# EAGLE design BLDCM (EAGLE 9.4.2)

## Sheet 1 of 4
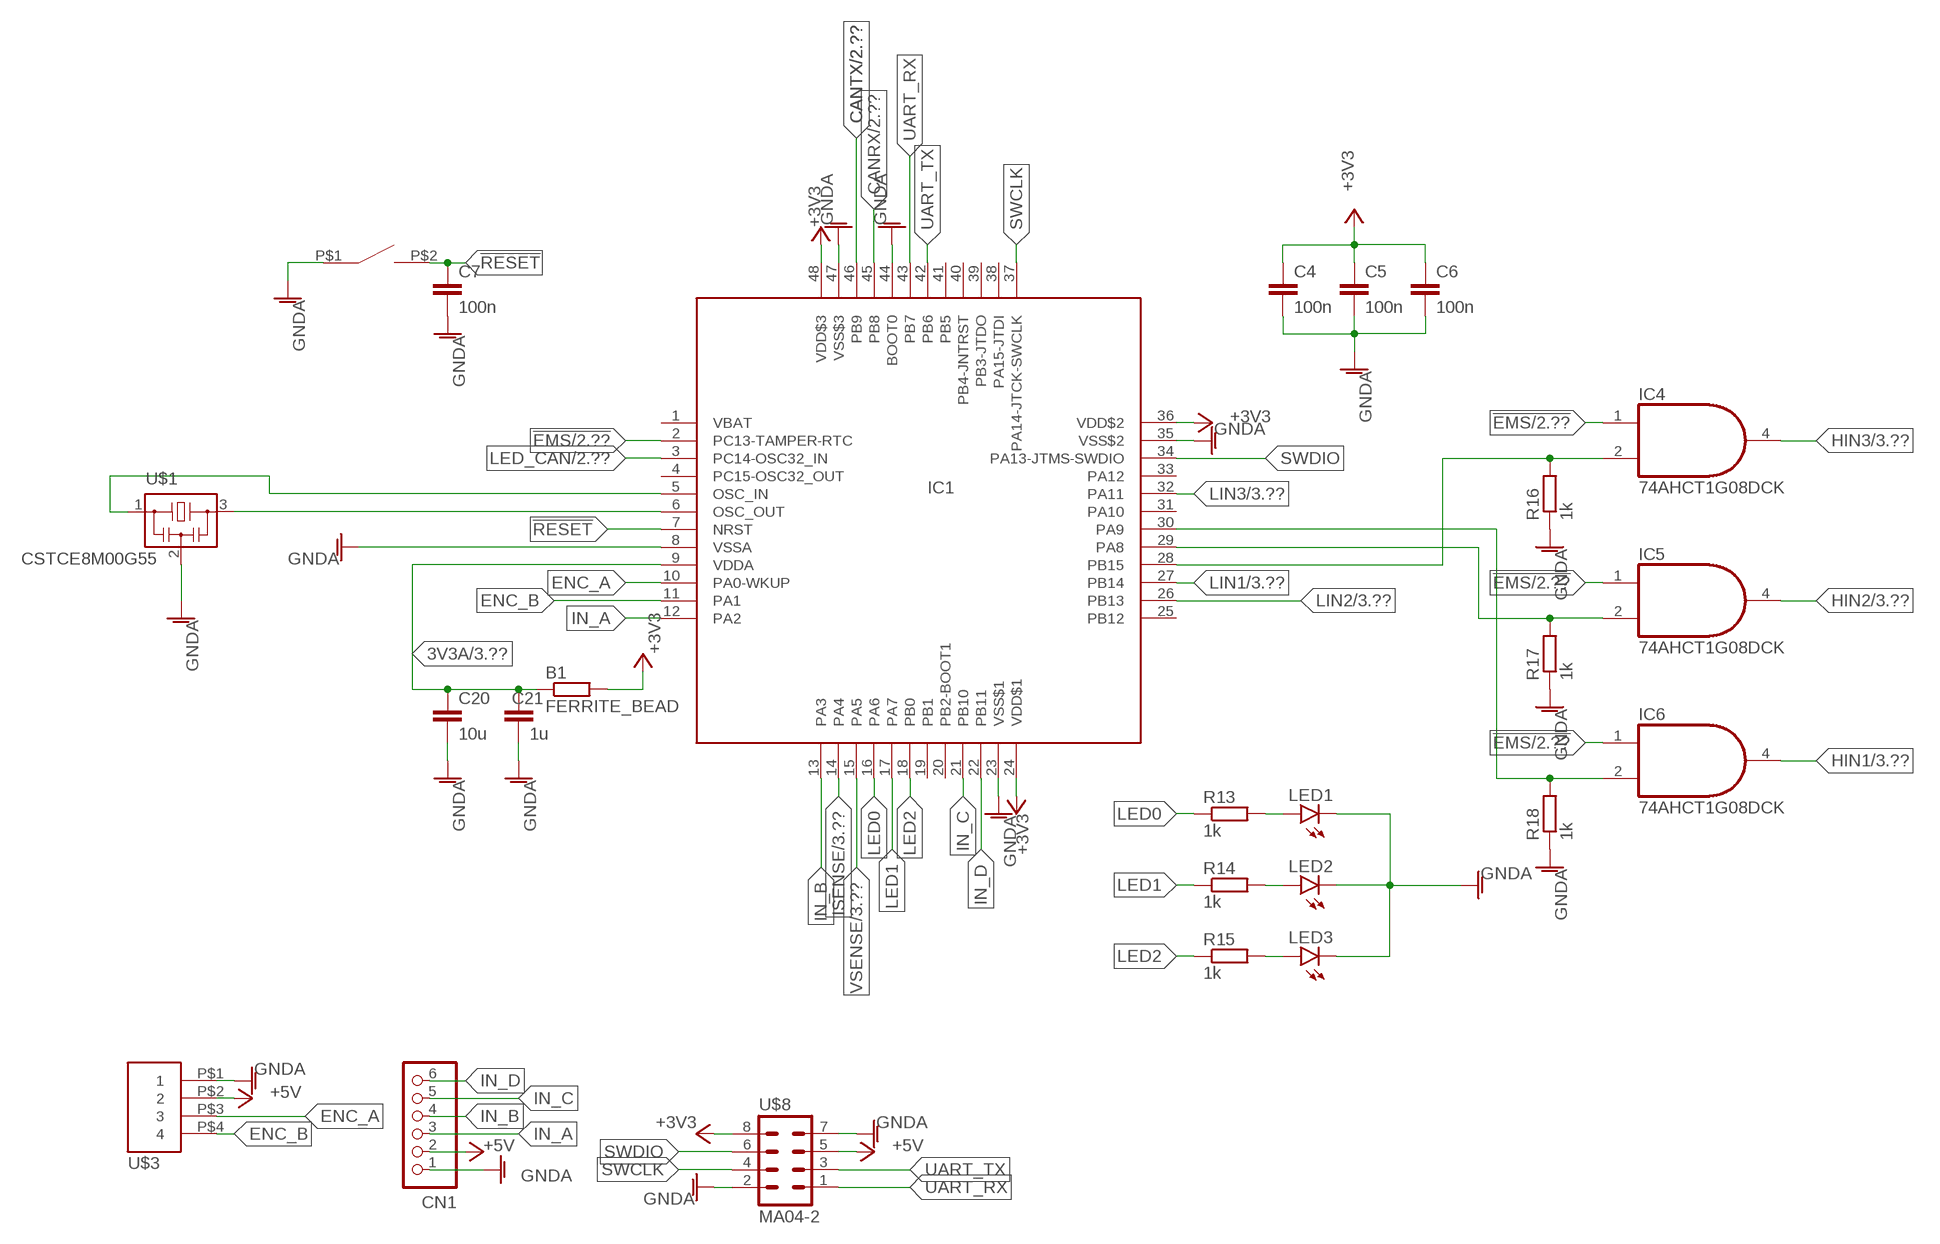
[diagram p0: schematic, sheet 1]

### Parts
B1  FERRITE_BEAD  R-EU_R0603  [R0603]
C4  100n  C-EUC0603  [C0603]
C5  100n  C-EUC0603  [C0603]
C6  100n  C-EUC0603  [C0603]
C7  100n  C-EUC0603  [C0603]
C20  10u  C-EUC0603  [C0603]
C21  1u  C-EUC0603  [C0603]
CN1  S6B-XH-A  [S6B-XH-A]
IC1  STM32F103C8  [LQFP48]
IC4  74AHCT1G08DCK  [SC70-5]
IC5  74AHCT1G08DCK  [SC70-5]
IC6  74AHCT1G08DCK  [SC70-5]
LED1  LEDCHIP-LED0805  [CHIP-LED0805]
LED2  LEDCHIP-LED0805  [CHIP-LED0805]
LED3  LEDCHIP-LED0805  [CHIP-LED0805]
R13  1k  R-EU_R0603  [R0603]
R14  1k  R-EU_R0603  [R0603]
R15  1k  R-EU_R0603  [R0603]
R16  1k  R-EU_R0603  [R0603]
R17  1k  R-EU_R0603  [R0603]
R18  1k  R-EU_R0603  [R0603]
U$1  CSTCE8M00G55  [CSTCE8M00G55]
U$3  XH-4-SIDE  [CON-XH-4-SIDE]
U$4  SWITCH_TACTILETOP  [SWITCH_TACTILE_3X6]
U$8  MA04-2  [MA04-2W]

### Nets
3V3A: B1.1 C20.1 C21.1 IC1.9(VDDA) ; also sheet 3
!EMS: IC1.2(PC13-TAMPER-RTC) IC4.1(I0) IC5.1(I0) IC6.1(I0) ; also sheet 2
!RESET: C7.1 IC1.7(NRST) U$4.P$2
+3V3: B1.2 C4.1 C5.1 C6.1 IC1.24(VDD$1) IC1.36(VDD$2) IC1.48(VDD$3) U$8.8 ; also sheet 2,4
+5V: CN1.2 U$3.P$2 U$8.5 ; also sheet 4
CANRX: IC1.45(PB8) ; also sheet 2
CANTX: IC1.46(PB9) ; also sheet 2
ENC_A: IC1.10(PA0-WKUP) U$3.P$3
ENC_B: IC1.11(PA1) U$3.P$4
GNDA: C4.2 C5.2 C6.2 C7.2 C20.2 C21.2 CN1.1 IC1.8(VSSA) IC1.23(VSS$1) IC1.35(VSS$2) IC1.44(BOOT0) IC1.47(VSS$3) LED1.C LED2.C LED3.C R16.1 R17.1 R18.1 U$1.2 U$3.P$1 U$4.P$1 U$8.2 U$8.7 ; also sheet 2,3,4
HIN1: IC6.4(O) ; also sheet 3
HIN2: IC5.4(O) ; also sheet 3
HIN3: IC4.4(O) ; also sheet 3
IN_A: CN1.3 IC1.12(PA2)
IN_B: CN1.4 IC1.13(PA3)
IN_C: CN1.5 IC1.21(PB10)
IN_D: CN1.6 IC1.22(PB11)
ISENSE: IC1.14(PA4) ; also sheet 3
LED0: IC1.16(PA6) R13.1
LED1: IC1.17(PA7) R14.1
LED2: IC1.18(PB0) R15.1
LED_CAN: IC1.3(PC14-OSC32_IN) ; also sheet 2
LIN1: IC1.27(PB14) ; also sheet 3
LIN2: IC1.26(PB13) ; also sheet 3
LIN3: IC1.32(PA11) ; also sheet 3
N$1: IC1.6(OSC_OUT) U$1.3
N$2: IC1.5(OSC_IN) U$1.1
N$3: IC1.30(PA9) IC6.2(I1) R18.2
N$5: IC1.28(PB15) IC4.2(I1) R16.2
N$11: IC1.29(PA8) IC5.2(I1) R17.2
N$23: LED3.A R15.2
N$24: LED1.A R13.2
N$25: LED2.A R14.2
SWCLK: IC1.37(PA14-JTCK-SWCLK) U$8.4
SWDIO: IC1.34(PA13-JTMS-SWDIO) U$8.6
UART_RX: IC1.43(PB7) U$8.1
UART_TX: IC1.42(PB6) U$8.3
VSENSE: IC1.15(PA5) ; also sheet 3
Unconnected: IC1.1(VBAT) IC1.4(PC15-OSC32_OUT) IC1.19(PB1) IC1.20(PB2-BOOT1) IC1.25(PB12) IC1.31(PA10) IC1.33(PA12) IC1.38(PA15-JTDI) IC1.39(PB3-JTDO) IC1.40(PB4-JNTRST) IC1.41(PB5)

## Sheet 2 of 4
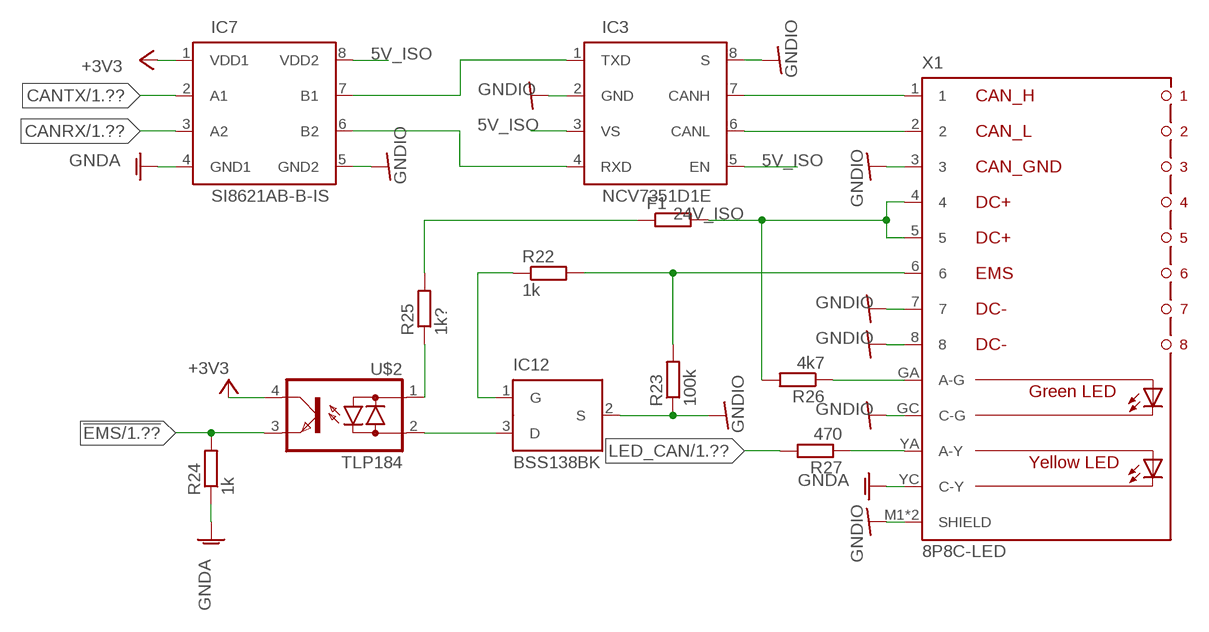
[diagram p1: schematic, sheet 2]

### Parts
F1  R-EU_R1206  [R1206]
IC3  NCV7351D1E  [SO08]
IC7  SI8621AB-B-IS  [SO08]
IC12  BSS138BK  [SOT23]
R22  1k  R-EU_R0603  [R0603]
R23  100k  R-EU_R0603  [R0603]
R24  1k  R-EU_R0603  [R0603]
R25  1k?  R-EU_R0603  [R0603]
R26  4k7  R-EU_R0603  [R0603]
R27  470  R-EU_R0603  [R0603]
U$2  TLP184  [11-4M1S]
X1  8P8C-LED  [8P8C-LED]

### Nets
5V_ISO: IC3.3(VS) IC3.5(EN) IC7.8(VDD2) ; also sheet 4
24V_ISO: F1.1 R25.2 ; also sheet 4
!EMS: R24.2 U$2.3(E) ; also sheet 1
+3V3: IC7.1(VDD1) U$2.4(C) ; also sheet 1,4
CANRX: IC7.3(A2) ; also sheet 1
CANTX: IC7.2(A1) ; also sheet 1
GNDA: IC7.4(GND1) R24.1 X1.YC(C-Y) ; also sheet 1,3,4
GNDIO: IC3.2(GND) IC3.8(S) IC7.5(GND2) IC12.2(S) R23.1 X1.3 X1.7 X1.8 X1.GC(C-G) X1.M1(SHIELD) X1.M2(SHIELD) ; also sheet 4
LED_CAN: R27.2 ; also sheet 1
N$4: IC3.1(TXD) IC7.7(B1)
N$7: IC3.7(CANH) X1.1
N$10: IC3.6(CANL) X1.2
N$21: IC3.4(RXD) IC7.6(B2)
N$22: R22.2 R23.2 X1.6
N$26: F1.2 R26.2 X1.4 X1.5
N$31: IC12.1(G) R22.1
N$32: IC12.3(D) U$2.2(AC2)
N$33: R25.1 U$2.1(AC1)
N$36: R26.1 X1.GA(A-G)
N$38: R27.1 X1.YA(A-Y)

## Sheet 3 of 4
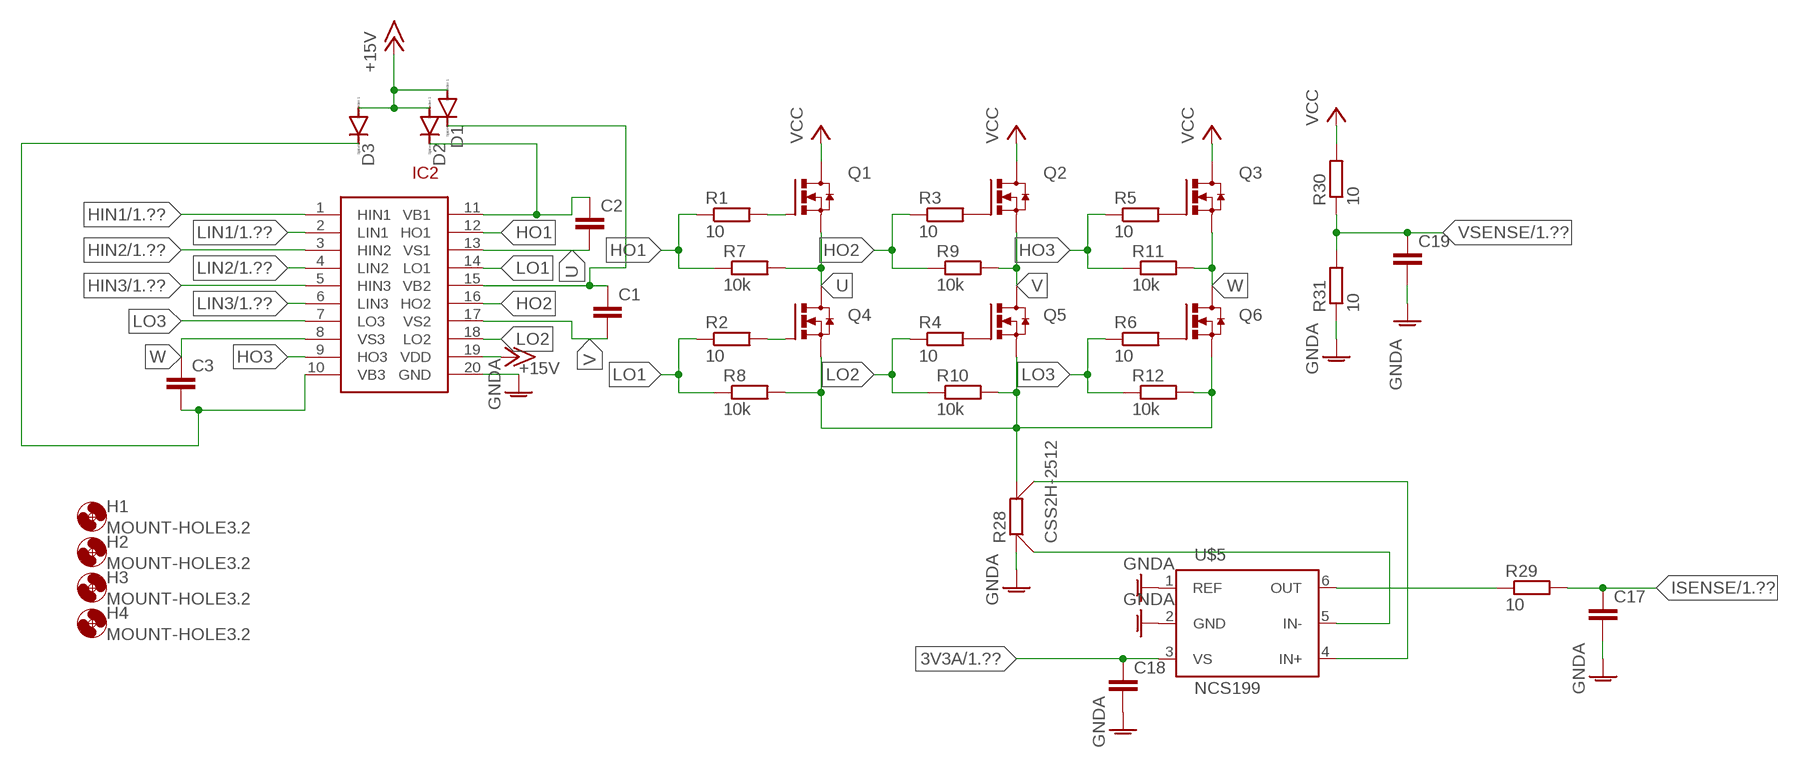
[diagram p2: schematic, sheet 3]

### Parts
C1  C-EUC0603  [C0603]
C2  C-EUC0603  [C0603]
C3  C-EUC0603  [C0603]
C17  C-EUC0603  [C0603]
C18  C-EUC0603  [C0603]
C19  C-EUC0603  [C0603]
D1  DIODE-SOD323-R  [SOD323-R]
D2  DIODE-SOD323-R  [SOD323-R]
D3  DIODE-SOD323-R  [SOD323-R]
H1  MOUNT-HOLE3.2  [3,2]
H2  MOUNT-HOLE3.2  [3,2]
H3  MOUNT-HOLE3.2  [3,2]
H4  MOUNT-HOLE3.2  [3,2]
IC2  FAN7888MX  [SOIC20S]
Q1  N-MOSFET-  [SOT669]
Q2  N-MOSFET-  [SOT669]
Q3  N-MOSFET-  [SOT669]
Q4  N-MOSFET-  [SOT669]
Q5  N-MOSFET-  [SOT669]
Q6  N-MOSFET-  [SOT669]
R1  10  R-EU_R0603  [R0603]
R2  10  R-EU_R0603  [R0603]
R3  10  R-EU_R0603  [R0603]
R4  10  R-EU_R0603  [R0603]
R5  10  R-EU_R0603  [R0603]
R6  10  R-EU_R0603  [R0603]
R7  10k  R-EU_R0603  [R0603]
R8  10k  R-EU_R0603  [R0603]
R9  10k  R-EU_R0603  [R0603]
R10  10k  R-EU_R0603  [R0603]
R11  10k  R-EU_R0603  [R0603]
R12  10k  R-EU_R0603  [R0603]
R28  CSS2H-2512  [CSS2H-2512]
R29  10  R-EU_R0603  [R0603]
R30  10  R-EU_R0603  [R0603]
R31  10  R-EU_R0603  [R0603]
U$5  NCS199  [SOT65P210X110-6]

### Nets
3V3A: C18.1 U$5.3(VS) ; also sheet 1
+15V: D1.A D2.A D3.A IC2.19(VDD) ; also sheet 4
GNDA: C17.2 C18.2 C19.2 IC2.20(GND) R28.1$1 R28.1$2 R31.1 U$5.1(REF) U$5.2(GND) ; also sheet 1,2,4
HIN1: IC2.1(HIN1) ; also sheet 1
HIN2: IC2.3(HIN2) ; also sheet 1
HIN3: IC2.5(HIN3) ; also sheet 1
HO1: IC2.12(HO1) R1.1 R7.1
HO2: IC2.16(HO2) R3.1 R9.1
HO3: IC2.9(HO3) R5.1 R11.1
ISENSE: C17.1 R29.2 ; also sheet 1
LIN1: IC2.2(LIN1) ; also sheet 1
LIN2: IC2.4(LIN2) ; also sheet 1
LIN3: IC2.6(LIN3) ; also sheet 1
LO1: IC2.14(LO1) R2.1 R8.1
LO2: IC2.18(LO2) R4.1 R10.1
LO3: IC2.7(LO3) R6.1 R12.1
N$6: C1.1 D1.C IC2.15(VB2)
N$8: C2.1 D2.C IC2.11(VB1)
N$9: C3.2 D3.C IC2.10(VB3)
N$12: Q1.4(GATE) R1.2
N$13: Q4.4(GATE) R2.2
N$14: Q2.4(GATE) R3.2
N$15: Q5.4(GATE) R4.2
N$16: Q3.4(GATE) R5.2
N$17: Q6.4(GATE) R6.2
N$18: Q4.1(SOURCE) Q4.2(SOURCE) Q4.3(SOURCE) Q5.1(SOURCE) Q5.2(SOURCE) Q5.3(SOURCE) Q6.1(SOURCE) Q6.2(SOURCE) Q6.3(SOURCE) R8.2 R10.2 R12.2 R28.2$1 R28.2$2
N$19: R28.2S U$5.4(IN+)
N$20: R28.1S U$5.5(IN-)
N$37: R29.1 U$5.6(OUT)
U: C2.2 IC2.13(VS1) Q1.1(SOURCE) Q1.2(SOURCE) Q1.3(SOURCE) Q4.5(DRAIN) R7.2
V: C1.2 IC2.17(VS2) Q2.1(SOURCE) Q2.2(SOURCE) Q2.3(SOURCE) Q5.5(DRAIN) R9.2
VCC: Q1.5(DRAIN) Q2.5(DRAIN) Q3.5(DRAIN) R30.2 ; also sheet 4
VSENSE: C19.1 R30.1 R31.2 ; also sheet 1
W: C3.1 IC2.8(VS3) Q3.1(SOURCE) Q3.2(SOURCE) Q3.3(SOURCE) Q6.5(DRAIN) R11.2

## Sheet 4 of 4
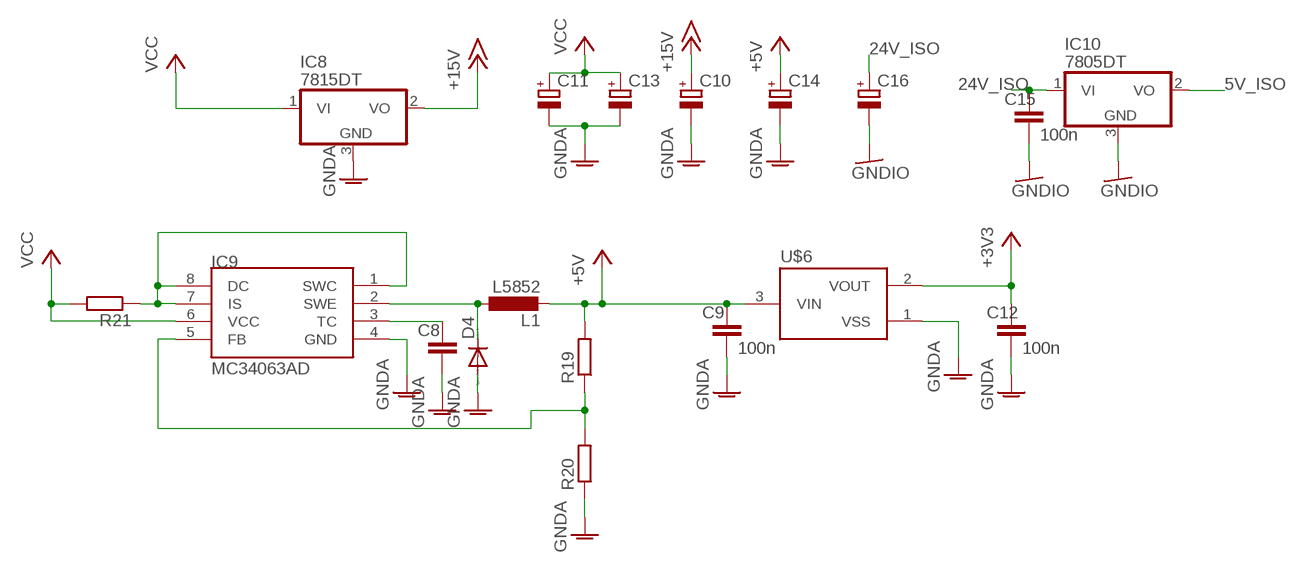
[diagram p3: schematic, sheet 4]

### Parts
C8  C-EUC0603  [C0603]
C9  100n  C-EUC0603  [C0603]
C10  CPOL-EUE2.5-5  [E2,5-5]
C11  CPOL-EUE5-10.5  [E5-10,5]
C12  100n  C-EUC0603  [C0603]
C13  CPOL-EUE5-10.5  [E5-10,5]
C14  CPOL-EUE2.5-5  [E2,5-5]
C15  100n  C-EUC0603  [C0603]
C16  CPOL-EUE2.5-5  [E2,5-5]
D4  DIODE-SOD123  [SOD123]
IC8  7815DT  7824DT  [TO252]
IC9  MC34063AD  [SOIC8]
IC10  7805DT  7824DT  [TO252]
L1  L5852  [L5852]
R19  R-EU_R0603  [R0603]
R20  R-EU_R0603  [R0603]
R21  R-EU_R0603  [R0603]
U$6  XC6206  [SOT95P240X110-3]

### Nets
5V_ISO: IC10.2(VO) ; also sheet 2
24V_ISO: C15.1 C16.+ IC10.1(VI) ; also sheet 2
+3V3: C12.1 U$6.2(VOUT) ; also sheet 1,2
+5V: C9.1 C14.+ L1.P$2 R19.2 U$6.3(VIN) ; also sheet 1
+15V: C10.+ IC8.2(VO) ; also sheet 3
GNDA: C8.2 C9.2 C10.- C11.- C12.2 C13.- C14.- D4.A IC8.3(GND) IC9.4(GND) R20.1 U$6.1(VSS) ; also sheet 1,2,3
GNDIO: C15.2 C16.- IC10.3(GND) ; also sheet 2
N$27: D4.C IC9.2(SWE) L1.P$1
N$28: IC9.5(FB) R19.1 R20.2
N$29: IC9.1(SWC) IC9.7(IS) IC9.8(DC) R21.1
N$30: C8.1 IC9.3(TC)
VCC: C11.+ C13.+ IC8.1(VI) IC9.6(VCC) R21.2 ; also sheet 3

## Power pins joined to a net without a drawn wire
+3V3: IC4.5(+3V3) IC5.5(+3V3) IC6.5(+3V3)
GNDA: IC4.3(GNDA) IC5.3(GNDA) IC6.3(GNDA)

## Library data of the parts
B1 R1-R27 R29-R31 = mylib:R-EU_R0603
C1-C7 C17-C21 = rcl:C-EU: CAPACITOR, European symbol; SPICEPREFIX: C
C8 C9 C12 C15 = mylib:C-EU: CAPACITOR, European symbol; SPICEPREFIX: C
C10 C11 C13 C14 C16 = rcl:CPOL-EU: POLARIZED CAPACITOR, European symbol; SPICEPREFIX: C
CN1 = jst-xh:S6B-XH-A: Wire-to-Board 2.5mm pitch side mount connector Source: http://www.jst-mfg.com/product/pdf/jpn/XH.pdf http://www.jst-mfg.com/product/detail.php?series=277
D1-D3 = diode:DIODE-: DIODE
D4 = mylib:DIODE-: DIODE
F1 = mylib:R-EU_: RESISTOR, European symbol; SPICEPREFIX: R
H1-H4 = holes:MOUNT-HOLE: MOUNTING HOLE with drill center marker
IC1 = stm32_mcu:STM32F103C8: STMicroelectronics STM32F103C8 Mainstream Performance line, ARM Cortex-M3 MCU with 64 Kbytes Flash, 72 MHz CPU, motor control, USB and CAN references: datasheet <https://www.st.com/resource/en/datasheet/stm32f103c8.pdf> product page <https://www.st.com/ja/microcontrollers/stm32f103c8.html>
IC2 = mylib:FAN7888MX
IC3 = on-semi:NCV7351D1E: High Speed CAN Transceiver Source: NCV7351-D.PDF <http://www.onsemi.com/PowerSolutions/document/NCV7351-D.PDF>
IC4-IC6 = mylib:74*1G08: 2-input AND gate
IC7 = mylib:SI8621AB-B-IS: 1 Mbps Digital Isolator 1 Mbps, 2.5 kVRMS Digital Isolator Source: Si86xx.pdf <https://www.silabs.com/documents/public/data-sheets/Si86xx.pdf>
IC8 IC10 = mylib:78*: Positive VOLTAGE REGULATOR Source: http://cache.national.com/ds/LM/LM78L05.pdf http://www.fairchildsemi.com/ds/LM/LM7805.pdf
IC9 = mylib:MC34063
IC12 = mylib:BSS138BK: BSS138BK MOSFET https://jp.rs-online.com/web/p/mosfets/7920894/ Source: Data sheet <https://docs-apac.rs-online.com/webdocs/1270/0900766b81270fbc.pdf>; MF: MAXIM; MPN: MAX6520EUR-T; OC_FARNELL: unknown; OC_NEWARK: 02J4586
L1 = mylib:L5852
LED1-LED3 = mylib:LED: LED OSRAM: - CHIPLED LG R971, LG N971, LY N971, LG Q971, LY Q971, LO R971, LY R971 LH N974, LH R974 LS Q976, LO Q976, LY Q976 LO Q996 - Hyper CHIPLED LW Q18S LB Q993, LB Q99A, LB R99A - SideLED LS A670, LO A670, LY A670, LG A670, LP A670 LB A673, LV A673, LT A673, LW A673 LH A674 LY A675 LS A676, LA A676, LO A676, LY A676, LW A676 LS A679, LY A679, LG A679 - Hyper Micro SIDELED® LS Y876, LA Y876, LO Y876, LY Y876 LT Y87S - SmartLED LW L88C, LW L88S LB L89C, LB L89S, LG L890 LS L89K, LO L89K, LY L89K LS L896, LA L896, LO L896, LY L896 - TOPLED LS T670, LO T670, LY T670, LG T670, LP T670 LSG T670, LSP T670, LSY T670, LOP T670, LYG T670 LG T671, LOG T671, LSG T671 LB T673, LV T673, LT T673, LW T673 LH T674 LS T676, LA T676, LO T676, LY T676, LB T676, LH T676, LSB T676, LW T676 LB T67C, LV T67C, LT T67C, LS T67K, LO T67K, LY T67K, LW E67C LS E67B, LA E67B, LO E67B, LY E67B, LB E67C, LV E67C, LT E67C LW T67C LS T679, LY T679, LG T679 LS T770, LO T770, LY T770, LG T770, LP T770 LB T773, LV T773, LT T773, LW T773 LH T774 LS E675, LA E675, LY E675, LS T675 LS T776, LA T776, LO T776, LY T776, LB T776 LHGB T686 LT T68C, LB T68C - Hyper Mini TOPLED® LB M676 - Mini TOPLED Santana® LG M470 LS M47K, LO M47K, LY M47K Source: http://www.osram.convergy.de LUXEON: - LUMILED® LXK2-PW12-R00, LXK2-PW12-S00, LXK2-PW14-U00, LXK2-PW14-V00 LXK2-PM12-R00, LXK2-PM12-S00, LXK2-PM14-U00 LXK2-PE12-Q00, LXK2-PE12-R00, LXK2-PE12-S00, LXK2-PE14-T00, LXK2-PE14-U00 LXK2-PB12-K00, LXK2-PB12-L00, LXK2-PB12-M00, LXK2-PB14-N00, LXK2-PB14-P00, LXK2-PB14-Q00 LXK2-PR12-L00, LXK2-PR12-M00, LXK2-PR14-Q00, LXK2-PR14-R00 LXK2-PD12-Q00, LXK2-PD12-R00, LXK2-PD12-S00 LXK2-PH12-R00, LXK2-PH12-S00 LXK2-PL12-P00, LXK2-PL12-Q00, LXK2-PL12-R00 Source: www.luxeon.com KINGBRIGHT: KA-3528ASYC Source: www.kingbright.com
Q1-Q6 = mylib:N-MOSFET-*
R28 = mylib:CSS2H-2512: Bourns Model CSS2H-2512 Series Current Sense Resistor <https://www.bourns.com/docs/Product-Datasheets/css2h-2512.pdf>
U$1 = resonator:CSTCE8M00G55
U$2 = mylib:TLP184
U$3 = con-xh:XH-4-SIDE
U$4 = switch-tactile:SWITCH_TACTILE
U$5 = mylib:NCS199
U$6 = torex:XC6206
U$8 = mylib:MA04-2
X1 = mylib:8P8C-LED: generic 8P8C connector with two LED's; OC_FARNELL: unknown; OC_NEWARK: unknown

## Board
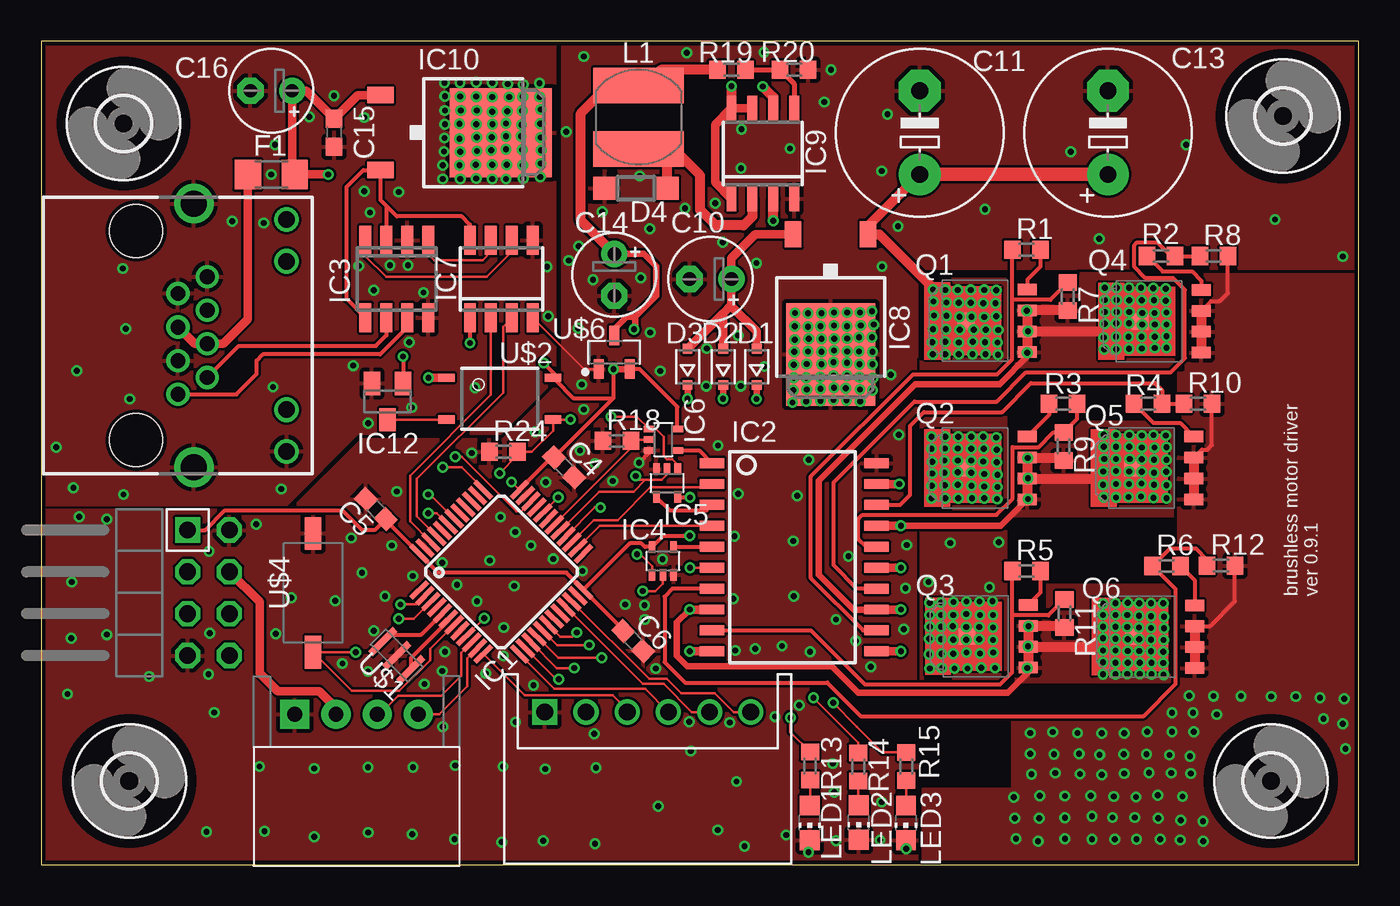
[diagram p4: board, top side]
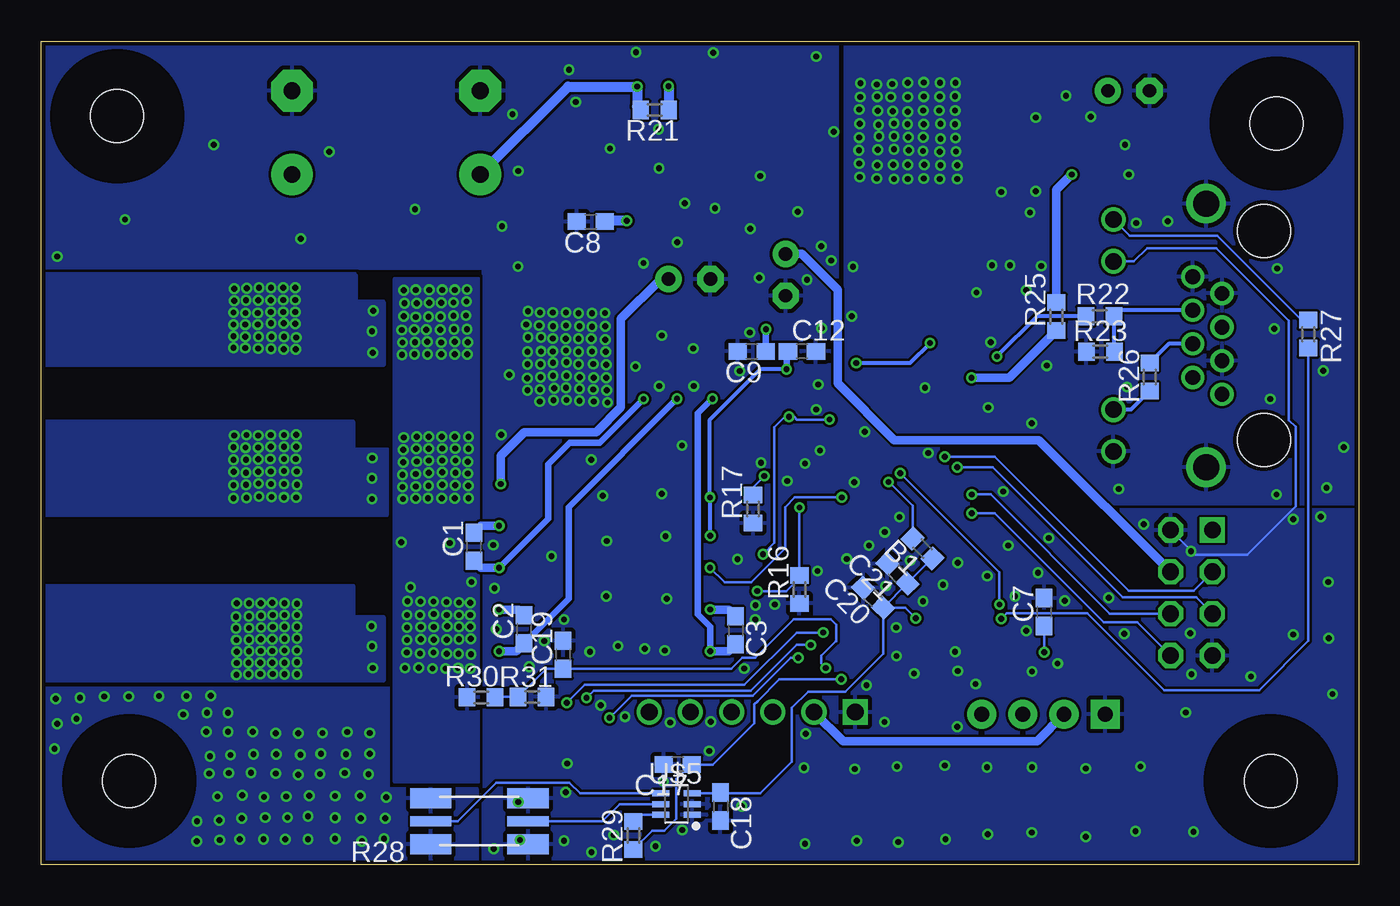
[diagram p5: board, bottom side, seen from below]

Size 80 x 50 mm. Coordinates in mm from the lower left corner, seen from the top.
Outline: 0,0 80,0 80,50 0,50 0,0
Copper layers (1*16): Top 0.035mm / dielectric 1.5mm / Bottom 0.035mm
Design rules "SeeedStudio_2layer_DRU_no_angle_20140221": minimum track width 6mil, minimum drill 12mil, track to track 6mil, track to pad 6mil, pad to pad 6mil, via to via 6mil, smd to smd 0mil, copper to edge 10mil, drill to drill 10mil, minimum pad ring 10mil, minimum via ring 6mil, stop-mask expansion 2mil, vias tented up to drill 100mil, thermal gap 10mil

### Footprints (pad centres in the part's own frame; a part is rotated, then mirrored left to right if it is on the bottom)
R0603 = smd 1 x 1.1: 1 -0.85,0; 2 0.85,0
C0603 = smd 1.1 x 1: 1 -0.85,0; 2 0.85,0
E2,5-5 = drill 0.813 pad 1.6: + -1.27,0 | drill 0.813 pad 1.6 octagon: - 1.27,0
E5-10,5 = drill 1.016 pad 2.54: + -2.54,0 | drill 1.016 pad 2.54 octagon: - 2.54,0
S6B-XH-A = drill 1.016 square: 1 6.25,0 | drill 1.016: 2 3.75,0; 3 1.25,0; 4 -1.25,0; 5 -3.75,0; 6 -6.25,0
SOD323-R = smd 0.6 x 0.6: A 1.1,0; C -1.1,0
SOD123 = smd 1.4 x 1.4: A 1.9,0; C -1.9,0
R1206 = smd 1.6 x 1.803: 1 -1.422,0; 2 1.422,0
3,2 = hole 3.2: 0,0
LQFP48 = smd 1.4 x 0.3: 1 -4.3,2.75; 2 -4.3,2.25; 3 -4.3,1.75; 4 -4.3,1.25; 5 -4.3,0.75; 6 -4.3,0.25; 7 -4.3,-0.25; 8 -4.3,-0.75; 9 -4.3,-1.25; 10 -4.3,-1.75; 11 -4.3,-2.25; 12 -4.3,-2.75; 25 4.3,-2.75; 26 4.3,-2.25; 27 4.3,-1.75; 28 4.3,-1.25; 29 4.3,-0.75; 30 4.3,-0.25; 31 4.3,0.25; 32 4.3,0.75; 33 4.3,1.25; 34 4.3,1.75; 35 4.3,2.25; 36 4.3,2.75 | smd 0.3 x 1.4: 13 -2.75,-4.3; 14 -2.25,-4.3; 15 -1.75,-4.3; 16 -1.25,-4.3; 17 -0.75,-4.3; 18 -0.25,-4.3; 19 0.25,-4.3; 20 0.75,-4.3; 21 1.25,-4.3; 22 1.75,-4.3; 23 2.25,-4.3; 24 2.75,-4.3; 37 2.75,4.3; 38 2.25,4.3; 39 1.75,4.3; 40 1.25,4.3; 41 0.75,4.3; 42 0.25,4.3; 43 -0.25,4.3; 44 -0.75,4.3; 45 -1.25,4.3; 46 -1.75,4.3; 47 -2.25,4.3; 48 -2.75,4.3
SOIC20S = smd 0.6 x 1.5: 1 -5.715,-5; 2 -4.445,-5; 3 -3.175,-5; 4 -1.905,-5; 5 -0.635,-5; 6 0.635,-5; 7 1.905,-5; 8 3.175,-5; 9 4.445,-5; 10 5.715,-5; 11 5.715,5; 12 4.445,5; 13 3.175,5; 14 1.905,5; 15 0.635,5; 16 -0.635,5; 17 -1.905,5; 18 -3.175,5; 19 -4.445,5; 20 -5.715,5
SO08 = smd 0.72 x 1.78: 1 -1.905,-2.35; 2 -0.635,-2.35; 3 0.635,-2.35; 4 1.905,-2.35; 5 1.905,2.35; 6 0.635,2.35; 7 -0.635,2.35; 8 -1.905,2.35
SC70-5 = smd 0.4 x 0.7: 1 -0.65,-0.85; 2 0,-0.85; 3 0.65,-0.85; 4 0.65,0.85; 5 -0.65,0.85
TO252 = smd 1 x 1.6: 1 -2.28,-4.8; 2 2.28,-4.8 | smd 5.4 x 6.2: 3 0,2.5
SOIC8 = smd 0.6 x 1.5: 1 -1.905,-2.75; 2 -0.635,-2.75; 3 0.635,-2.75; 4 1.905,-2.75; 5 1.905,2.75; 6 0.635,2.75; 7 -0.635,2.75; 8 -1.905,2.75
SOT23 = smd 1 x 1.4: 1 -0.95,-1.1; 2 0.95,-1.1; 3 0,1.1
L5852 = smd 2.15 x 5.5: P$1 1.925,0; P$2 -1.925,0
CHIP-LED0805 = smd 1.2 x 1.2: A 0,-1.05; C 0,1.05
SOT669 = smd 1.15 x 0.7: 1 -2.725,1.905; 2 -2.725,0.635; 3 -2.725,-0.635; 4 -2.725,-1.905 | smd 1 x 1: 5 1,0
CSS2H-2512 = smd 2.5 x 1.2: 1$1 -2.95,1.4; 1$2 -2.95,-1.4; 2$1 2.95,1.4; 2$2 2.95,-1.4 | smd 2.5 x 0.6: 1S -2.95,0; 2S 2.95,0
CSTCE8M00G55 = smd 0.4 x 2.1: 1 -1.2,0; 2 0,0; 3 1.2,0
11-4M1S = smd 1 x 0.5: 1 -3.24,1.27; 2 -3.24,-1.27; 3 3.24,-1.27; 4 3.24,1.27
CON-XH-4-SIDE = drill 0.9 pad 1.778 square: P$1 10,2.3 | drill 0.9 pad 1.778: P$2 7.5,2.3; P$3 5,2.3; P$4 2.5,2.3
SWITCH_TACTILE_3X6 = smd 2 x 1: P$1 -3.6,0; P$2 3.6,0
SOT65P210X110-6 = smd 1.02 x 0.36: 1 -0.955,0.65; 2 -0.955,0; 3 -0.955,-0.65; 4 0.955,-0.65; 5 0.955,0; 6 0.955,0.65
SOT95P240X110-3 = smd 1.18 x 0.609: 1 -1.024,0.95; 2 -1.024,-0.95; 3 1.024,0
MA04-2W = drill 1.016 octagon: 1 -3.81,-1.27; 2 -3.81,1.27; 3 -1.27,-1.27; 4 -1.27,1.27; 5 1.27,-1.27; 6 1.27,1.27; 7 3.81,-1.27 | drill 1.016 square: 8 3.81,1.27
8P8C-LED = drill 0.9 pad 1.3: 1 3.57,-3.81; 2 2.55,-2.03; 3 1.53,-3.81; 4 0.51,-2.03; 5 -0.51,-3.81; 6 -1.53,-2.03; 7 -2.55,-3.81; 8 -3.57,-2.03 | drill 1 pad 1.422: GA 4.5,2.78; GC 7.04,2.78; YA -7.04,2.78; YC -4.5,2.78 | drill 1.6 pad 2.184: M1 -8,-2.85; M2 8,-2.85 | hole 3.2: 6.35,-6.35; -6.35,-6.35

### Placement (x,y rotation side)
B1  26.49,19.2 135 bottom
C1  53.72,19.3 90 bottom
C2  50.67,14.3 90 bottom
C3  37.85,14.22 270 bottom
C4  31.75,24.13 315 top
C5  20.32,21.59 135 top
C6  35.94,13.59 315 top
C7  19.1,15.34 90 bottom
C8  46.63,39.04 180 bottom
C9  36.86,31.17 180 bottom
C10  40.64,35.56 180 top
C11  53.34,44.45 90 top
C12  33.81,31.17 0 bottom
C13  64.77,44.45 90 top
C14  34.8,35.81 270 top
C15  17.78,44.45 270 top
C16  13.97,46.99 180 top
C17  41.35,6.1 180 bottom
C18  38.76,3.53 270 bottom
C19  48.31,12.75 90 bottom
C20  29.49,16.21 135 bottom
C21  28.02,17.68 135 bottom
CN1  36.83,9.27 180 top
D1  43.43,30.23 90 top
D2  41.4,30.23 90 top
D3  39.24,30.23 90 top
D4  36.12,41.07 180 top
F1  13.97,41.91 180 top
H1  5,45 0 top
H2  75.39,45.45 0 top
H3  5.35,5.08 0 top
H4  74.66,5.08 0 top
IC1  27.94,17.78 45 top
IC2  45.72,18.67 270 top
IC3  21.59,35.56 180 top
IC4  37.74,18.44 0 top
IC5  38,23.16 180 top
IC6  37.77,25.81 270 top
IC7  27.94,35.56 0 top
IC8  47.93,33.48 180 top
IC9  43.81,43.18 0 top
IC10  25.4,44.45 270 top
IC12  21.03,28.12 180 top
L1  36.27,45.39 270 top
LED1  46.66,2.54 180 top
LED2  49.63,2.57 180 top
LED3  52.5,2.54 180 top
Q1  57.15,33.02 180 top
Q2  57.15,24.08 180 top
Q3  57.2,13.87 180 top
Q4  67.72,32.99 180 top
Q5  67.26,24.08 180 top
Q6  67.31,13.84 180 top
R1  59.82,37.34 0 top
R2  68,36.96 180 top
R3  62.05,27.99 180 top
R4  67.21,27.99 180 top
R5  59.82,17.83 0 top
R6  68.33,18.14 0 top
R7  62.33,34.49 270 top
R8  71.2,36.96 0 top
R9  62.08,25.4 270 top
R10  70.23,27.99 0 top
R11  62.13,15.27 270 top
R12  71.63,18.16 0 top
R13  46.69,5.99 270 top
R14  49.61,5.94 270 top
R15  52.53,5.97 270 top
R16  33.96,16.71 90 bottom
R17  36.78,21.59 90 bottom
R18  34.95,25.73 0 top
R19  41.91,48.26 180 top
R20  45.72,48.26 180 top
R21  42.75,45.82 180 bottom
R22  15.72,33.3 0 bottom
R23  15.7,31.14 0 bottom
R24  28.07,25.07 0 top
R25  18.36,33.27 90 bottom
R26  12.7,29.62 90 bottom
R27  3.07,32.21 270 bottom
R28  53.39,2.64 180 bottom
R29  44.04,1.78 270 bottom
R30  53.29,10.16 180 bottom
R31  50.19,10.19 180 bottom
U$1  21.59,12.7 315 top
U$2  27.84,28.3 0 top
U$3  25.4,11.43 180 top
U$4  16.51,16.51 270 top
U$5  41.43,3.68 180 bottom
U$6  34.8,31.11 90 top
U$8  10.16,16.51 90 top
X1  12.12,32.13 270 top

### Tracks (layer width: path | path; a pad name or v marks a point on that pad's centre or on a via)
3V3A  (via drill 0.35)
  Top 0.152: IC1.9 26.89,14.96 v26.9,14.96
  Bottom 0.152: B1.1 C21.1 C20.1 | v26.9,14.96 27.54,15.6 C20.1 | C20.1 28.89,12.82 31.19,10.52 33.43,10.52 34.42,9.53 34.42,6.25 36.33,4.33 38.68,4.33 38.71,4.33 | 38.71,4.33 U$5.3 | C18.1 38.71,4.33
5V_ISO
  Top 0.254: 20.95,40.01 20.6,40.36 IC10.2 19.56,42.17 18.54,41.15 18.54,34.35 IC3.5 | 20.95,40.01 IC3.3 | IC7.8 26.04,38.86 25.53,39.37 21.59,39.37 20.95,40.01
24V_ISO  (via drill 0.35)
  Top 0.508: IC10.1 19.21,46.73 C15.1 16.09,46.99 C16.+ 15.24,42.06 F1.1 v17.42,41.91
  Bottom 0.508: v17.42,41.91 18.36,40.97 R25.2
!EMS  (via drill 0.35)
  Top 0.152: v32.13,27.03 U$2.3 31.08,26.35 29.79,25.07 R24.2 28.92,24.85 v27.84,23.77 | IC5.1 38.65,24.29 38.33,24.61 37.97,24.61 37.8,24.79 37.8,25.98 37.32,26.46 IC6.1 36.17,27.2 v34.59,27.2 | v36.17,18.85 36.37,18.85 37.09,18.12 IC4.1 | IC1.2 22.78,15.8 v21.82,15.8
  Bottom 0.152: v36.17,18.85 35.48,19.53 35.48,26.57 34.85,27.2 v34.59,27.2 34.29,27.2 34.11,27.03 v32.13,27.03 | v21.82,15.8 21.82,17.75 v27.84,23.77
!RESET  (via drill 0.35)
  Top 0.152: IC1.7 23.61,13.1 23.61,12.41 21.75,10.55 18.87,10.55 U$4.P$2 v19.09,12.91 v19.1,12.9
  Bottom 0.152: v19.1,12.9 C7.1
+3V3  (via drill 0.35)
  Top 0.152: U$2.4 31.2,29.45 | C6.1 35,14.53 35,14.59 | IC1.36 29.03,22.77 v28.55,23.24
  Top 0.254: IC1.36 31,24.73 C4.1 34.75,28.33 | C5.1 20.99,20.84 IC1.48 24.1,17.73 31.88,17.73 IC1.24 | IC1.24 34.89,14.72 35,14.59 | v34.75,30.07 34.75,28.33 | U$8.8 9.96,20.32 11.15,21.52 18.29,21.52 19.49,20.32 20.25,20.32 C5.1 | IC5.5 39.38,22.32 v39.4,22.3 | v39.37,19.96 37.77,19.96 IC4.5 36.66,19.29 36.44,19.5 35.75,19.5 IC1.24 | IC6.5 38.62,27.8 36.33,30.09 U$6.2 | 34.75,28.33 32.31,28.33 31.2,29.45 31.2,29.76 v30.5,30.45 | IC7.1 v26.04,31.67 | C5.1
  Top 0.406: v34.75,30.07 34.76,30.09 U$6.2
  Bottom 0.152: B1.2 27.09,21.79 v28.55,23.24
  Bottom 0.254: v39.37,19.96 39.37,22.28 v39.4,22.3 39.4,27.03 36.32,30.1 34.77,30.1 v34.75,30.07 | v26.04,31.67 27.25,30.45 v30.5,30.45
  Bottom 0.406: v34.75,30.07 34.75,31.08 C12.1
+5V  (via drill 0.35)
  Top 0.406: C14.+ 36.58,37.08 37.34,36.32 37.34,34.54 36.07,33.27 | 36.07,33.27 35.56,33.27 34.8,32.51 U$6.3 | 36.07,33.27 36.07,32.59 v35.99,32.51
  Top 0.508: U$8.5 13.26,15.95 13.26,11.63 14.35,10.54 16.89,10.54 17.9,9.53 U$3.P$2
  Top 0.61: R19.2 37.62,48.26 36.67,47.31 L1.P$2 34.46,47.31 32.77,45.62 32.77,39.12 C14.+
  Bottom 0.406: v35.99,32.51 36.01,32.5 C9.1
  Bottom 0.508: U$3.P$2 19.54,7.49 31.3,7.49 CN1.2 | U$8.5 19.43,25.78 28.19,25.78 31.65,29.23 31.65,34.9 33.83,37.08 C14.+
+15V  (via drill 0.35)
  Top 0.508: IC8.2 43.36,38.28 41.91,36.83 C10.+ 41.91,33.99 | 41.91,33.99 41.4,33.48 | 41.4,33.48 D2.A | D3.A 41.4,33.48 | 41.91,33.99 41.91,33.91 43.43,32.38 D1.A | v52.09,23.11 IC2.19
  Bottom 0.508: C10.+ 42.39,35.56 44.81,33.15 44.81,27.76 46.3,26.26 50.67,26.26 52.09,24.84 v52.09,23.11
CANRX
  Top 0.152: IC1.45 22.81,21.14 22.81,23.42 28.04,28.65 28.04,32.68 IC7.3
CANTX
  Top 0.152: IC1.46 22.4,20.84 22.4,23.62 27.3,28.52 IC7.2
ENC_A
  Top 0.152: U$3.P$3 20.56,9.13 21.68,10.25 24.28,10.25 25.5,11.47 25.5,12.87 IC1.10
ENC_B
  Top 0.152: IC1.11 25.88,12.54 25.88,10.84 24.17,9.13 U$3.P$4
GNDA  (via drill 0.35)
  Top 0.152: IC7.4 32.97,30.09 U$6.1
  Top 0.254: IC6.3 36.92,25.03 v36.3,24.41
  Bottom 0.152: X1.YC 13.66,36.63 12.85,37.44 8.66,37.44 4.24,33.02 4.24,26.99 3.84,26.58 3.84,21.77 6.78,18.82 9.93,18.82 U$8.7
  other vias: 13.26,5.97 28.09,14.4 31.09,18.57 24.36,18.34 27.89,21.11 29.74,19.38 26.47,16 28.78,20.19 25.25,16.99 18.29,12.22 20.19,14.2 19.84,11.73 28.07,12.67 30.63,23.22 26.14,24.99 32.72,25.15 33.63,24.36 37.72,18.54 37.31,11.91 46.69,12.93 42.14,13 43.36,13.11 44.98,13.28 45.77,33.5 46.56,33.48 47.37,33.48 48.13,33.53 48.95,33.53 49.71,33.53 50.44,33.6 45.75,32.69 46.56,32.66 47.32,32.69 48.13,32.74 48.92,32.69 49.76,32.74 50.55,32.79 45.75,31.88 46.61,31.93 47.37,31.93 48.16,31.93 48.95,31.95 49.66,32.03 50.44,32.03 45.72,31.14 46.56,31.17 47.37,31.14 48.13,31.22 48.95,31.17 49.66,31.17 50.47,31.14 49.68,30.38 50.47,30.38 48.92,30.48 48.11,30.51 47.37,30.38 46.48,30.4 50.5,29.54 49.68,29.59 48.92,29.69 48.11,29.69 47.29,29.59 48.13,28.96 48.84,28.93 49.71,28.85 50.47,28.8 48.11,28.22 48.9,28.19 49.73,28.12 47.32,28.91 47.32,28.17 45.69,30.35 45.69,29.57 46.46,29.57 46.48,28.85 46.46,28.12 45.67,28.8 45.62,28.07 27.23,18.47 28.73,16.92 39.34,8.69 41.81,8.64 46.02,9.68 50.37,12.01 42.7,1.12 41.07,2.11 37.47,3.56 33.58,7.95 29.9,10.9 36.63,15.75 35.46,15.8 36.65,14.88 42.01,16.15 23.27,10.97 24.51,12.93 24.36,11.76 27,11.61 30,26.29 32.94,27.64 32.82,29.16 36.4,35.64 33.5,35.51 32.61,32.56 41.38,37.8 36.35,41.81 34.06,39.65 52.55,19.41 50.93,1.5 51.03,3.81 48.26,1.45 45.24,1.8 48.16,4.39 42.21,5.05 39.45,6.91 34.7,23.29 36.98,32.31 37.59,29.97 43.92,30.25 42.32,32.13 40.41,31.34 46.61,24.59 52.02,38.76 47.96,48.26 32.94,49.07 31.88,44.5 32.64,37.54 32.03,36.68 45.9,22.4 48.26,14.88 49.45,13.59 44.55,8.99 24.38,8.38 28.8,8.66 3.99,20.98 2.31,21.13 3.99,13.97 6.55,11.43 14.25,14.02 15.19,16.21 10.19,19.02 13.06,20.68 10.24,14.05 10.16,11.56 21.29,19.38 17.86,16.03 20.88,16.31 22.56,17.53 39.09,39.85 40.92,40.16 42.52,44.65 42.49,42.29 45.47,43.48 51.03,42.11 51.05,36.32 51.59,29.74 43.43,36.53 42.47,29.06 40.39,29.06 42.32,22.53 45.69,16.31 1.83,13.74 13.56,2.03 19.84,5.92 19.86,1.96 16.59,5.84 16.59,1.7 22.58,5.92 22.53,1.85 25.15,6.02 25.1,1.55 28.04,5.97 27.97,1.37 30.61,5.82 30.48,1.45 33.68,5.89 33.63,1.27 1.85,17.17 1.6,10.36 10.52,9.25 10.03,2.01 19.48,17.73 18.82,19.84 32.87,17.83 42.09,19.94 45.67,19.66 41.1,25.45 36.96,38.61 39.19,49.3 43.89,49.33 47.55,46.3 51.38,45.57 62.51,43.28 79.02,36.93 74.9,39.17 57.3,39.8 64.24,38 69.52,43.71 52.48,16.79 52.37,14.3 49.02,18.72 52.07,26.11 21.59,22.66 48.06,6.15 52.53,0.97 46.58,0.76
  pour Bottom (rank 6): 0.02,21.51 15.29,21.51 19.56,25.78 28.24,25.78 31.67,29.21 31.67,50.09 80.06,50.09 80.09,50.06 80.09,36.25 53.16,36.25 53.16,-0.08 -0.03,-0.08 -0.03,21.47
  pour Top (rank 6): -0.03,21.49 -0.03,-0.08 0,-0.1 53.16,-0.1 53.16,36.22 53.19,36.25 80.09,36.25 80.09,50.09 31.67,50.09 31.67,29.39 28.07,25.78 19.48,25.78 15.19,21.49
GNDIO  (via drill 0.35)
  other vias: 19.28,36.35 17.78,46.69 13.97,41.91 16.28,45.42 19.61,40.89 19.96,39.6 22.35,31.72 18.95,30.3 26.34,28.96 30.78,33.3 24.49,47.47 25.43,47.47 26.42,47.5 27.38,47.47 28.32,47.4 29.26,47.37 30.25,47.45 24.51,46.66 25.45,46.63 26.42,46.63 27.38,46.61 28.42,46.61 29.24,46.63 30.28,46.61 24.51,45.8 25.48,45.8 26.44,45.8 27.38,45.72 28.3,45.75 29.21,45.77 30.33,45.85 24.51,44.96 25.4,44.98 26.42,44.96 27.41,44.96 28.22,45.01 29.16,44.93 30.3,44.98 24.49,44.12 25.4,44.07 26.44,44.17 27.36,44.17 28.22,44.22 29.13,44.22 30.33,44.15 24.46,43.31 25.45,43.28 26.47,43.33 27.33,43.38 28.22,43.43 29.21,43.41 30.35,43.38 24.38,42.47 25.4,42.47 26.39,42.49 27.38,42.49 28.27,42.49 29.24,42.47 30.33,42.57 30.3,41.76 29.26,41.66 28.22,41.63 27.38,41.63 26.42,41.66 25.45,41.63 24.38,41.63 23.22,34.75 22.28,36.4 21.18,36.4 20.19,34.87 22.5,27.76 19.86,26.8 5,22.48 1.96,22.89 0.91,25.35 11.61,39.07 13.51,38.96 14.2,43.71 4.95,36.2 2.16,30 5.13,32.54 5.38,28.27 14.07,29.01 14.58,22.81 30.71,36.3 21.72,40.84 19.61,45.36
  pour Top (rank 6): -0.05,21.89 14.88,21.89 19.2,26.21 27.86,26.21 31.19,29.54 31.19,50.11 -0.05,50.11
  pour Bottom (rank 6): 0,21.92 14.91,21.92 19.2,26.21 27.94,26.21 31.14,29.41 31.17,29.41 31.17,50.09 0,50.09
HIN1
  Top 0.254: IC6.4 39.95,25.16 IC2.1
HIN2
  Top 0.254: IC5.4 38.15,21.51 40.39,21.51 IC2.3
HIN3
  Top 0.254: IC4.4 38.41,19.3 IC2.5
HO1
  Top 0.254: IC2.12 49.91,14.22 46.74,17.4 46.74,23.57 52.93,29.77 58.04,29.77 58.95,30.68 58.95,34.29 | R1.1 58.95,37.32 58.95,34.29 | R7.1 61.28,34.29 58.95,34.29
HO2
  Top 0.254: IC2.16 50.14,19.3 50.11,19.28 49.62,19.77 49.62,20.99 49.86,21.23 57.99,21.23 58.98,22.23 58.98,25.35 58.98,25.36 60.57,25.36 61.46,26.25 R9.1 62.9,27.07 R3.1
HO3
  Top 0.254: IC2.9 46.74,14.22 50.01,10.95 58.22,10.95 58.95,11.68 58.95,15.14 | R5.1 58.95,17.82 58.95,15.14 | R11.1 61.15,15.14 58.95,15.14
IN_A
  Top 0.152: IC1.12 29.35,10.29 34.69,10.29 35.58,9.4 CN1.3
IN_B
  Top 0.152: IC1.13 31.16,10.67 36.68,10.67 CN1.4
IN_C
  Top 0.152: IC1.21 36.52,10.97 37.8,10.97 39.5,9.27 CN1.5
IN_D
  Top 0.152: IC1.22 36.92,11.28 37.97,11.28 38.85,10.4 40.91,10.4 42.04,9.27 CN1.6
ISENSE  (via drill 0.35)
  Top 0.152: IC1.14 31.29,11.25 v31.42,11.25
  Bottom 0.152: R29.2 42.91,2.06 42.16,2.06 41.43,2.79 41.43,5.2 | C17.1 41.43,5.22 41.43,5.2 | 41.43,5.2 40.55,6.07 39.22,6.07 36.7,8.59 36.7,9.73 36.5,9.93 35.18,11.25 v31.42,11.25
LED0  (via drill 0.35)
  Top 0.152: v45.49,8.91 45.49,8.04 R13.1 | v34.04,12.57 31.38,12.57 IC1.16
  Bottom 0.152: v34.04,12.57 34.49,12.57 36.8,10.26 44.15,10.26 v45.49,8.91
LED1  (via drill 0.35)
  Top 0.152: R14.1 49.61,7.42 v46.89,10.13 | IC1.17 31.32,13.34 v33.27,13.34
  Bottom 0.152: v33.27,13.34 33.3,13.36 34.14,13.36 36.93,10.57 46.46,10.57 v46.89,10.13
LED2  (via drill 0.35)
  Top 0.152: R15.1 51.08,6.82 49.52,8.38 49.53,8.38 v48.08,9.83 | v32.51,14.1 32.26,13.84 31.52,13.84 IC1.18
  Bottom 0.152: v32.51,14.1 34.14,14.1 37.31,10.92 46.99,10.92 v48.08,9.83
LED_CAN  (via drill 0.35)
  Top 0.152: IC1.3 22.62,14.94 v21.72,14.94
  Bottom 0.152: v21.72,14.94 21.38,15.27 16.49,15.27 11.82,10.6 6.06,10.6 3.07,13.59 R27.2
LIN1
  Top 0.152: IC2.2 40.52,22.91 36.98,22.91 35,20.92 33.56,20.92 IC1.27
LIN2
  Top 0.152: IC2.4 33.92,20.57 IC1.26
LIN3  (via drill 0.35)
  Top 0.152: IC1.32 v31.39,22.3 | IC2.6 v39.4,18.03
  Bottom 0.152: v31.39,22.3 34.24,22.3 34.82,21.72 34.82,19.2 36.88,17.14 38.51,17.14 v39.4,18.03
LO1
  Top 0.254: IC2.14 49.53,16.76 48.11,18.19 48.11,23.22 53.01,28.12 58.01,28.12 59.79,29.9 68.58,29.9 69.44,30.76 69.44,34.9 68.73,35.61 67.05,35.61 66.37,36.29 66.37,37.62 66.53,37.79 67.76,37.79 68.63,36.92 68.81,36.92 R2.1 R8.1
LO2
  Top 0.254: IC2.18 52.15,21.84 52.76,22.45 52.76,26.64 53.59,27.48 58.34,27.48 60.1,29.23 67.61,29.23 68.06,28.79 R4.1 R10.1
LO3
  Top 0.254: IC2.7 38.33,16.76 37.85,16.28 37.85,12.29 39.09,11.05 47.73,11.05 49.76,9.02 66.93,9.02 68.89,10.97 68.89,16.74 R6.1 68.54,19.2 70.1,19.2 70.78,18.53 R12.1
N$1
  Top 0.254: IC1.6 24.72,14.82 23.54,13.63 22.44,12.54 U$1.3
N$2
  Top 0.254: U$1.1 21.16,13.97 23.07,13.97 IC1.5
N$3
  Top 0.152: IC1.30 35.8,25.29 R18.2 35.88,25.81 IC6.2
N$4
  Top 0.152: IC3.1 23.5,37.08 23.88,36.7 26.8,36.7 27.3,37.21 IC7.7
N$5  (via drill 0.35)
  Top 0.152: IC4.2 37.74,17.07 37.29,16.61 v36.52,16.61 | IC1.28 33.62,21.69 v33.96,21.69
  Bottom 0.152: v36.52,16.61 34.77,16.61 33.96,17.42 R16.2 v33.96,21.69
N$6  (via drill 0.35)
  Top 0.406: D1.C v43.43,28.27
  Top 0.508: IC2.15 v52.2,18.03
  Bottom 0.406: v43.43,28.27 46.08,25.63 47.9,25.63 49.23,24.31 49.23,21.01 v52.2,18.03
  Bottom 0.508: v52.2,18.03 53.3,18.03 C1.1
N$7
  Top 0.254: X1.1 11.85,28.56 13.08,29.79 13.08,30.61 13.46,30.99 20.57,30.99 22.23,32.64 IC3.7
N$8  (via drill 0.35)
  Top 0.406: D2.C v41.4,28.3
  Top 0.508: v52.2,12.95 IC2.11
  Bottom 0.406: v41.4,28.3 47.98,21.72 47.98,16.14 C2.1
  Bottom 0.508: v52.2,12.95 51.17,12.95 C2.1
N$9  (via drill 0.35)
  Top 0.406: D3.C v39.24,28.3
  Top 0.508: IC2.10 v39.37,12.95
  Bottom 0.406: v39.37,12.95 39.37,14.46 40.13,15.21 40.13,27.41 v39.24,28.3
  Bottom 0.508: v39.37,12.95 38.27,12.95 C3.2
N$10
  Top 0.254: IC3.6 20.95,32.13 20.32,31.5 12,31.5 X1.2
N$11  (via drill 0.35)
  Top 0.152: IC1.29 33.88,22.66 35.97,22.66 36.68,23.37 | IC5.2 38.11,23.91 38.11,23.8 37.68,23.37 36.68,23.37 | v36.09,23.6 36.32,23.37 36.68,23.37
  Bottom 0.152: v36.09,23.6 36.78,22.91 R17.2
N$12
  Top 0.254: R1.2 60.67,36.31 59.88,35.52 Q1.4
N$13
  Top 0.254: R2.2 68.09,36.02 69.88,36.02 70.44,35.45 Q4.4
N$14
  Top 0.254: R3.2 61.2,27.31 Q2.4
N$15
  Top 0.254: R4.2 67.53,26.82 69.15,26.82 Q5.4
N$16
  Top 0.254: R5.2 60.67,16.52 Q3.4
N$17
  Top 0.254: R6.2 70.03,17.28 Q6.4
N$18  (via drill 0.35)
  Top 0.254: Q6.3 70.97,14.48 72.48,15.99 R12.2 | Q4.3 71.03,34.21 71.55,34.21 72.05,34.71 R8.2 | Q5.3 70.47,25.2 70.79,25.2 71.08,25.49 R10.2
  Top 0.61: Q6.3 Q6.2 Q6.1 | Q4.3 Q4.2 Q4.1 | Q5.3 Q5.2 Q5.1
  other vias: 63.73,4.19 63.07,5.51 63.02,6.73 63.8,2.95 62.92,8 60.05,8 60.05,6.73 60.12,5.49 59.05,4.09 59.11,2.82 59.18,1.57 61.42,8.05 61.49,6.71 61.57,5.56 60.63,4.19 60.6,2.82 60.53,1.42 62.15,4.17 62.15,2.84 62.15,1.57 63.8,1.55 64.39,7.98 64.26,6.68 64.39,5.46 65.13,4.14 65.05,2.87 65.18,1.55 65.76,7.98 65.74,6.71 65.76,5.54 67.16,8.08 67.11,6.71 67.26,5.59 66.47,4.11 66.4,2.87 66.5,1.55 68.66,8.08 68.5,6.65 68.61,5.56 67.79,4.22 67.82,2.82 67.94,1.55 69.29,4.14 69.19,2.69 69.16,1.5 69.98,8.08 69.75,6.58 69.8,5.54 68.66,9.22 69.93,9.22 69.7,10.26 71.17,10.24 71.37,9.12 72.85,10.24 74.68,10.21 76.17,10.21 77.65,10.13 79.12,10.08 79.02,8.56 77.85,8.86 79.2,7.04 70.54,2.64 70.56,1.42
  pour Top: 69.49,35.81 80.09,35.81 80.09,-0.1 80.11,-0.13 53.58,-0.13 53.58,4.57 59.03,4.57 59.03,10.74 69.09,10.74 69.09,29.84 69.42,29.84 69.55,29.97 69.55,35.76
  pour Bottom: 53.57,4.62 53.57,-0.13 80.11,-0.13 80.11,10.69 80.09,10.72 58.98,10.72 58.95,10.74 58.95,4.62 53.64,4.62 53.59,4.57
N$19
  Bottom 0.152: R28.2S 54.71,2.64 52.38,4.98 47.93,4.98 47.28,4.33 U$5.4
N$20
  Bottom 0.152: R28.1S 45.92,2.64 44.88,3.68 U$5.5
N$21
  Top 0.152: IC7.6 28.57,37.21 27.05,35.69 20.95,35.69 19.68,36.96 IC3.4
N$22
  Bottom 0.254: R23.2 14.87,31.17 R22.2 14.85,33.28 14.47,33.66 X1.6
N$23
  Top 0.152: R15.2 52.53,3.62 LED3.A
N$24
  Top 0.152: R13.2 46.69,3.62 LED1.A
N$25
  Top 0.152: R14.2 49.61,3.64 LED2.A
N$26
  Top 0.508: F1.2 12.55,33.12 11.05,31.62 X1.4 9.33,31.62 X1.5
  Bottom 0.254: X1.4 11.54,31.62 R26.2
N$27
  Top 0.61: IC9.2 43.18,39.34 42.65,38.81 40.95,38.81 40.01,39.75 40.01,41.86 38.4,43.47 37.44,43.47 | 37.44,43.47 L1.P$1 | D4.C 38.02,42.89 37.44,43.47
N$28
  Top 0.305: R19.1 R20.2 45.72,47.41 IC9.5
N$29  (via drill 0.35)
  Top 0.508: IC9.7 IC9.8 40.92,44.94 40.92,41.42 IC9.1
  Top 0.61: v41.91,47.27 IC9.8
  Bottom 0.61: v41.91,47.27 41.91,45.83 R21.1
N$30  (via drill 0.35)
  Top 0.61: v44.45,39.09 IC9.3
  Bottom 0.61: v44.45,39.09 45.73,39.09 C8.1
N$31  (via drill 0.35)
  Top 0.254: v21.97,30.86 21.98,30.85 IC12.1
  Bottom 0.254: R22.1 19.53,33.3 v21.97,30.86
N$32
  Top 0.152: IC12.3 24.59,27.02 U$2.2
N$33  (via drill 0.35)
  Top 0.508: v23.52,29.57 U$2.1
  Bottom 0.508: v23.52,29.57 21.22,29.57 R25.1
N$36
  Bottom 0.254: R26.1 13.84,27.63 X1.GA
N$37
  Bottom 0.152: U$5.6 43.64,3.03 R29.1
N$38
  Bottom 0.152: X1.YA 13.9,38.18 8.59,38.18 3.47,33.06 R27.1
SWCLK  (via drill 0.35)
  Top 0.152: v24.38,24.13 25.53,24.13 26.89,22.77 IC1.37
  Bottom 0.152: U$8.4 9.88,16.23 14.33,16.23 22.23,24.13 v24.38,24.13
SWDIO  (via drill 0.35)
  Top 0.152: IC1.34 29.15,21.46 28.83,21.46 25.53,24.77 v25.15,24.77
  Bottom 0.152: U$8.6 10.03,16.64 13.97,16.64 22.1,24.77 v25.15,24.77
U  (via drill 0.35)
  Top 0.406: IC2.13 49.33,15.49 47.22,17.6 47.22,23.32 49.12,25.22 49.12,25.23 53.08,29.18 58.19,29.18 59.88,30.87 Q1.1
  Top 0.508: IC2.13 v52.2,15.49
  Top 0.61: Q1.2 Q1.3 62.32,33.66 R7.2 | Q1.2 Q1.1 | Q1.2 66.7,32.38 66.8,32.28 66.8,32.91 Q4.5
  Bottom 0.508: v52.2,15.49 51.02,15.49 C2.2
  other vias: 66.01,32.05 66.8,32.05 68.28,34.98 64.57,35.03 65.3,35.03 66.04,35.03 66.78,35.03 67.51,35 64.57,34.29 65.3,34.29 66.07,34.26 66.83,34.26 67.56,34.26 68.28,34.24 64.57,33.55 65.3,33.55 66.07,33.55 66.85,33.5 67.59,33.5 68.33,33.53 64.57,32.84 65.28,32.87 66.04,32.87 66.85,32.79 67.61,32.79 68.33,32.79 68.33,32.08 67.61,32.05 65.25,32.05 64.52,32 68.33,31.39 67.61,31.37 66.83,31.34 66.04,31.32 65.28,31.29 64.54,31.29 59.84,33.63 59.92,32.38 59.87,31.09
  pour Top: 69.04,35.84 61.01,35.84 61.01,34.19 59.21,34.19 59.21,30.28 69.06,30.28
  pour Bottom: 80.09,35.89 60.99,35.89 60.91,35.81 60.91,34.26 60.96,34.21 59.26,34.21 59.21,34.16 59.21,30.33 80.04,30.33 80.11,30.25 80.11,35.81 80.06,35.86
UART_RX  (via drill 0.35)
  Top 0.152: IC1.43 24.03,21.34 v23.5,21.34
  Bottom 0.152: U$8.1 13.46,14.73 15.49,14.73 22.1,21.34 v23.5,21.34
UART_TX  (via drill 0.35)
  Top 0.152: v23.5,22.48 23.59,22.48 IC1.42
  Bottom 0.152: U$8.3 15.11,15.24 22.35,22.48 v23.5,22.48
V  (via drill 0.35)
  Top 0.406: v52.2,20.57 58.27,20.57 Q2.1
  Top 0.508: IC2.17 v52.2,20.57
  Top 0.61: Q2.2 Q2.3 61.91,24.71 R9.2 | Q2.2 Q2.1 | Q2.2 66.32,23.44 66.73,23.85 66.5,24.08 Q5.5
  Bottom 0.508: v52.2,20.57 53.3,20.57 C1.2
  other vias: 65.25,26.09 66.07,26.09 66.83,26.06 67.54,26.09 68.28,26.06 65.25,25.37 66.07,25.37 66.83,25.32 67.59,25.32 68.33,25.35 68.33,24.59 67.56,24.59 66.83,24.61 66.09,24.64 65.25,24.64 65.25,23.9 66.07,23.88 66.83,23.85 67.56,23.8 68.3,23.85 65.25,23.11 66.04,23.11 66.8,23.14 67.56,23.06 68.33,23.04 65.25,22.3 66.01,22.33 66.78,22.35 67.54,22.28 68.33,22.25 64.52,26.11 64.52,25.37 64.54,24.64 64.49,23.88 64.47,23.06 64.52,22.3 59.92,22.2 59.92,23.47 59.89,24.69
  pour Bottom: 80.21,26.92 61.09,26.92 61.06,26.9 61.06,25.22 59.08,25.22 59.03,25.27 59.03,21.21 80.04,21.21 80.29,21.46 80.29,26.72 80.16,26.85
  pour Top: 59.08,25.25 59.08,21.23 59.11,21.21 68.68,21.21 68.68,26.82 61.11,26.82 61.04,26.75 61.04,25.27 60.99,25.22 59.11,25.22
VCC  (via drill 0.35)
  Top 0.61: v43.81,47.24 44.45,46.61 IC9.6 | C11.+ 50.21,38.78 IC8.1 50.89,38.28 Q1.5
  Top 0.813: C13.+ C11.+
  Bottom 0.61: R21.2 43.81,46.04 v43.81,47.24 48.01,47.24 C11.+
  other vias: 54.15,34.92 56.97,15.98 55.68,25.98 54.89,34.9 55.65,34.9 56.44,34.9 57.25,34.9 57.99,34.87 54.18,34.19 54.97,34.14 55.7,34.11 56.44,34.11 57.2,34.09 57.94,34.09 54.2,33.35 54.97,33.32 55.75,33.27 56.49,33.27 57.25,33.25 57.99,33.3 54.15,32.51 54.94,32.51 55.78,32.49 56.62,32.49 57.35,32.49 58.12,32.46 54.1,31.72 54.89,31.75 55.7,31.7 56.57,31.75 57.3,31.72 58.06,31.7 54.13,30.99 54.89,30.99 55.7,30.99 56.54,30.99 57.33,30.99 58.09,30.96 54.05,25.98 54.89,25.98 56.46,25.98 57.2,25.98 57.99,25.93 54.05,25.25 54.86,25.27 55.65,25.27 56.46,25.25 57.23,25.25 58.01,25.2 54.1,24.46 54.84,24.54 55.65,24.54 56.46,24.54 57.2,24.49 58.01,24.43 54.1,23.75 54.84,23.8 55.65,23.83 56.46,23.8 57.25,23.72 58.06,23.67 54.08,23.01 54.86,23.04 55.65,23.06 56.49,23.01 57.25,22.96 58.06,22.94 54.05,22.25 54.89,22.25 55.68,22.25 56.52,22.25 57.25,22.25 58.04,22.2 54.64,15.93 55.4,15.95 56.18,15.98 57.76,16 54.64,15.16 55.37,15.16 56.16,15.21 57,15.16 53.95,15.9 53.95,15.16 53.95,14.45 54.64,14.45 55.35,14.48 56.16,14.43 57.78,15.16 56.95,14.43 57.78,14.4 53.92,13.72 54.64,13.69 55.37,13.67 56.16,13.67 56.95,13.69 57.78,13.64 53.9,12.78 54.66,12.8 55.37,12.8 56.18,12.88 57,12.83 57.81,12.88 53.95,11.91 54.69,11.94 55.45,11.91 56.24,11.91 57.07,11.96 57.91,11.94 53.87,17.17 55.19,19.53 58.14,19.58 57.58,16.84
  pour Bottom: 58.52,35.59 53.49,35.59 53.49,5.03 58.52,5.03
  pour Top: 53.47,35.53 58.5,35.53 58.52,35.51 58.52,5.05 53.54,5.05 53.47,4.98 53.47,35.48 53.49,35.51
VSENSE  (via drill 0.35)
  Top 0.152: IC1.15 31.31,11.94 v32.36,11.94
  Bottom 0.152: v32.36,11.94 32.64,12.22 32.64,12.68 31.75,13.56 31.73,13.56 31.73,14.58 32.05,14.91 34.31,14.91 36.66,12.57 37.44,12.57 38.11,11.9 C19.1 49.33,11.9 R31.2 52.41,10.19 R30.1
W  (via drill 0.35)
  Top 0.406: v39.37,15.49 38.58,14.71 38.58,12.68 39.22,12.04 48.01,12.04 49.61,10.44 58.68,10.44 59.93,11.68 Q3.1
  Top 0.508: IC2.8 v39.37,15.49
  Top 0.61: Q3.2 Q3.3 62.04,14.5 R11.2 | Q3.2 Q3.1 | Q3.2 65.7,13.23 Q6.5
  Bottom 0.508: v39.37,15.49 38.27,15.49 C3.1
  other vias: 65.96,15.9 66.67,15.88 67.39,15.88 68.12,15.88 65.23,15.16 65.94,15.16 66.65,15.11 67.39,15.09 68.17,15.06 65.23,14.45 65.94,14.43 66.65,14.4 67.39,14.38 68.17,14.35 65.23,13.72 65.96,13.69 66.67,13.69 67.39,13.67 68.15,13.64 65.23,13 65.96,12.98 66.67,12.98 67.39,12.95 68.12,12.93 65.23,12.27 65.96,12.27 66.7,12.27 67.41,12.27 68.12,12.24 65.23,11.56 65.94,11.58 66.7,11.58 67.41,11.56 68.15,11.53 65.23,15.88 64.47,15.85 64.47,15.16 64.47,14.45 64.47,13.74 64.47,13 64.47,12.29 64.47,11.56 59.94,14.48 59.92,13.26 59.87,11.94
  pour Top: 59.21,15.11 59.21,11.15 68.68,11.15 68.68,16.94 61.11,16.94 61.11,15.11 61.09,15.09 59.23,15.09
  pour Bottom: 61.06,16.94 61.06,15.06 59.23,15.06 59.21,15.04 59.21,11.18 80.34,11.18 80.34,16.89 80.29,16.94

### Text on the board
tPlace: brushless motor driver / ver 0.9.1